# EAGLE design Glock-O-Bot_v1.1 (EAGLE 7.5.0)
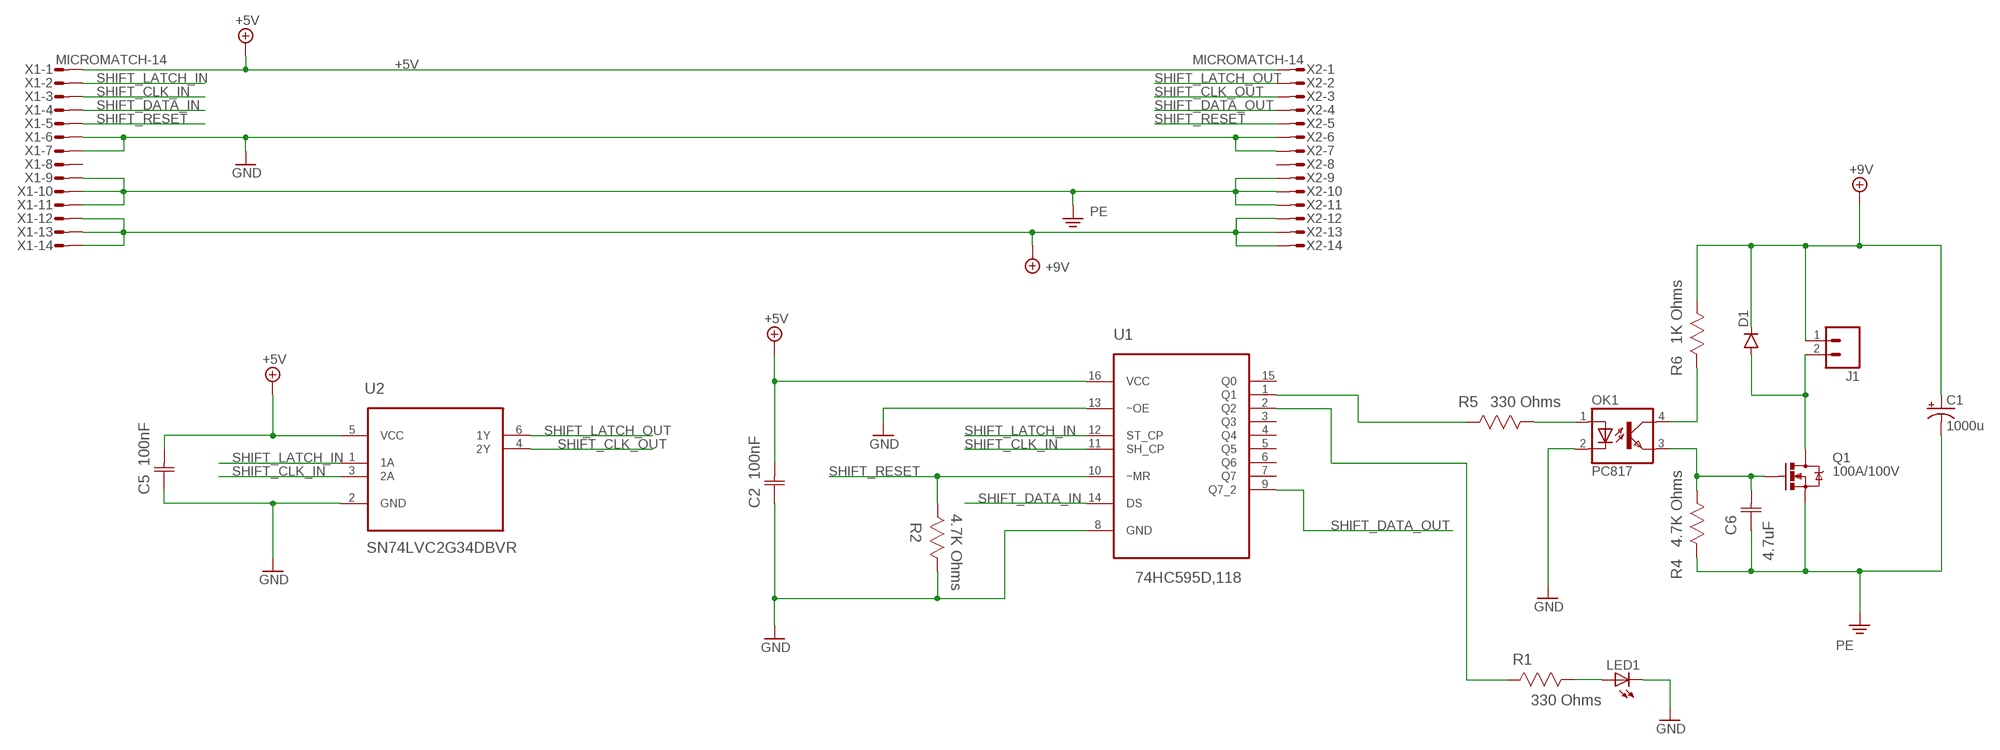
[diagram p0: schematic, sheet 1]

## Parts
C1  1000u  CAP_POLPTH4  [CPOL-RADIAL-1000UF-25V]
C2  100nF  C0805C104J5RACTU  [CAPC2013X110N]
C5  100nF  C0805C104J5RACTU  [CAPC2013X110N]
C6  4.7uF  C0805C104J5RACTU  [CAPC2013X110N]
D1  DIODEPTH  [DIODE-1N4001]
J1  M02JST-PTH-VERT  [JST-2-PTH-VERT]
LED1  LEDCHIPLED_1206  [CHIPLED_1206]
OK1  PC817  [DIL04]
Q1  100A/100V  MOSFET-NCHANNELPSMN7R0  [TO-263/D2PAK]
R1  330 Ohms  MC0.1W08051%9K1  [RESC2013X65N]
R2  4.7K Ohms  MC0.1W08051%9K1  [RESC2013X65N]
R4  4.7K Ohms  MC0.1W08051%9K1  [RESC2013X65N]
R5  330 Ohms  MC0.1W08051%9K1  [RESC2013X65N]
R6  1K Ohms  MC0.1W08051%9K1  [RESC2013X65N]
U1  74HC595D,118  [SOIC127P600X175-16N]
U2  SN74LVC2G34DBVR  [SOT95P280X145-6N]
X1  MICROMATCH-14  [MICROMATCH-14]
X2  MICROMATCH-14  [MICROMATCH-14]

## Nets
+5V: C2.2(C2) C5.2(C2) U1.16(VCC) U2.5(VCC) X1.1 X2.1
+9V: C1.+ D1.C J1.1 R6.1(R1) X1.12 X1.13 X1.14 X2.12 X2.13 X2.14
GND: C2.1(C1) C5.1(C1) LED1.C OK1.2(C) R2.1(R1) U1.8(GND) U1.13(~OE) U2.2(GND) X1.6 X1.7 X2.6 X2.7
N$1: D1.A J1.2 Q1.2(D)
N$2: R1.2(R2) U1.2(Q2)
N$3: C6.2(C2) OK1.3(EMIT) Q1.1(G) R4.1(R1)
N$4: LED1.A R1.1(R1)
N$5: OK1.4(COL) R6.2(R2)
N$6: R5.2(R2) U1.1(Q1)
N$7: OK1.1(A) R5.1(R1)
PE: C1.- C6.1(C1) Q1.3(S) R4.2(R2) X1.9 X1.10 X1.11 X2.9 X2.10 X2.11
SHIFT_CLK_IN: U1.11(SH_CP) U2.3(2A) X1.3
SHIFT_CLK_OUT: U2.4(2Y) X2.3
SHIFT_DATA_IN: U1.14(DS) X1.4
SHIFT_DATA_OUT: U1.9(Q7_2) X2.4
SHIFT_LATCH_IN: U1.12(ST_CP) U2.1(1A) X1.2
SHIFT_LATCH_OUT: U2.6(1Y) X2.2
SHIFT_RESET: R2.2(R2) U1.10(~MR) X1.5 X2.5
Unconnected: U1.3(Q3) U1.4(Q4) U1.5(Q5) U1.6(Q6) U1.7(Q7) U1.15(Q0) X1.8 X2.8

## Library data of the parts
C1 = SparkFun-Capacitors:CAP_POL: Capacitor Polarized These are standard SMD and PTH capacitors. Normally 10uF, 47uF, and 100uF in electrolytic and tantalum varieties. Always verify the external diameter of the through hole cap, it varies with capacity, voltage, and manufacturer. The EIA devices should be standard.; DESCRIPTION: 1000uF 16V; FARNELL: 9693610
C2 C5 = Kemet_By_element14_Batch_1:C0805C104J5RACTU: CAPACITOR, 0805; DESCRIPTION: 100nF 0805 50V; FARNELL: 1414663; MPN: C0805C104J5RACTU; OC_FARNELL: 1414663; OC_NEWARK: 64K2889; SUPPLIER: Kemet; TOLERANCE: ±5%; VOLTAGERATING: 50V
C6 = Kemet_By_element14_Batch_1:C0805C104J5RACTU: CAPACITOR, 0805; DESCRIPTION: 4.7uF 0805 16V; FARNELL: 1845746; MPN: C0805C104J5RACTU; OC_FARNELL: 1414663; OC_NEWARK: 64K2889; SUPPLIER: Murata; TOLERANCE: ±5%; VALUE: 100nF; VOLTAGERATING: 16V
D1 = SparkFun-DiscreteSemi:DIODE: Diode These are standard reverse protection diodes and small signal diodes. SMA package can handle up to about 1A. SOD-323 can handle about 200mA. What the SOD-323 package when ordering, there are some mfgs out there that are 5-pin packages.; DESCRIPTION: Diode 1N4001; FARNELL: 9564993
J1 = SparkFun-Connectors:M02: Standard 2-pin 0.1" header. Use with - straight break away headers ( PRT-00116) - right angle break away headers (PRT-00553) - swiss pins (PRT-00743) - machine pins (PRT-00117) - female headers (PRT-00115) Molex polarized connector foot print use with: PRT-08233 with associated crimp pins and housings. 2.54_SCREWTERM for use with PRT-10571. 3.5mm Screw Terminal footprints for PRT-08084 5mm Screw Terminal footprints for use with PRT-08432
LED1 = led:LED: LED OSRAM: - CHIPLED LG R971, LG N971, LY N971, LG Q971, LY Q971, LO R971, LY R971 LH N974, LH R974 LS Q976, LO Q976, LY Q976 LO Q996 - Hyper CHIPLED LW Q18S LB Q993, LB Q99A, LB R99A - SideLED LS A670, LO A670, LY A670, LG A670, LP A670 LB A673, LV A673, LT A673, LW A673 LH A674 LY A675 LS A676, LA A676, LO A676, LY A676, LW A676 LS A679, LY A679, LG A679 - Hyper Micro SIDELED® LS Y876, LA Y876, LO Y876, LY Y876 LT Y87S - SmartLED LW L88C, LW L88S LB L89C, LB L89S, LG L890 LS L89K, LO L89K, LY L89K LS L896, LA L896, LO L896, LY L896 - TOPLED LS T670, LO T670, LY T670, LG T670, LP T670 LSG T670, LSP T670, LSY T670, LOP T670, LYG T670 LG T671, LOG T671, LSG T671 LB T673, LV T673, LT T673, LW T673 LH T674 LS T676, LA T676, LO T676, LY T676, LB T676, LH T676, LSB T676, LW T676 LB T67C, LV T67C, LT T67C, LS T67K, LO T67K, LY T67K, LW E67C LS E67B, LA E67B, LO E67B, LY E67B, LB E67C, LV E67C, LT E67C LW T67C LS T679, LY T679, LG T679 LS T770, LO T770, LY T770, LG T770, LP T770 LB T773, LV T773, LT T773, LW T773 LH T774 LS E675, LA E675, LY E675, LS T675 LS T776, LA T776, LO T776, LY T776, LB T776 LHGB T686 LT T68C, LB T68C - Hyper Mini TOPLED® LB M676 - Mini TOPLED Santana® LG M470 LS M47K, LO M47K, LY M47K Source: http://www.osram.convergy.de LUXEON: - LUMILED® LXK2-PW12-R00, LXK2-PW12-S00, LXK2-PW14-U00, LXK2-PW14-V00 LXK2-PM12-R00, LXK2-PM12-S00, LXK2-PM14-U00 LXK2-PE12-Q00, LXK2-PE12-R00, LXK2-PE12-S00, LXK2-PE14-T00, LXK2-PE14-U00 LXK2-PB12-K00, LXK2-PB12-L00, LXK2-PB12-M00, LXK2-PB14-N00, LXK2-PB14-P00, LXK2-PB14-Q00 LXK2-PR12-L00, LXK2-PR12-M00, LXK2-PR14-Q00, LXK2-PR14-R00 LXK2-PD12-Q00, LXK2-PD12-R00, LXK2-PD12-S00 LXK2-PH12-R00, LXK2-PH12-S00 LXK2-PL12-P00, LXK2-PL12-Q00, LXK2-PL12-R00 Source: www.luxeon.com KINGBRIGHT: KA-3528ASYC Source: www.kingbright.com; DESCRIPTION: LED 1206; FARNELL: 8530076
OK1 = optocoupler:PC817: SHARP OPTO COUPLER; DESCRIPTION: FOD817A; FARNELL: 2322514; MPN: FOD817A; OC_FARNELL: 2322514; OC_NEWARK: 97K7059
Q1 = SparkFun-DiscreteSemi:MOSFET-NCHANNEL: Common NMOSFET Parts MFG P/N Store ID Prod ID FDD8780 TRANS-09984 SI7820DN TRANS-11055 FDS6630A IC-08089 2N7002PW TRANS-11151 FQP30N06L COM-10213 TRANS-10060 BSS123LT1G TRANS-08345 BSS138 TRANS-00830 BS170 2N7000; DESCRIPTION: BUK9637-100E; FARNELL: 2254193; PROD_ID: TRANS-12437
R1 R5 = Multicomp_By_element14_Batch_1:MC0.1W08051%9K1: RESISTOR, 0805; DESCRIPTION: 330R 0805; FARNELL: 2073741; MPN: MC0.1W08051%9K1; OC_FARNELL: 9333630; OC_NEWARK: 39K0321; SUPPLIER: Multicomp; TOLERANCE: ±1%; VALUE: 9.1K Ohms; WATTAGE: 1/10 W
R2 R4 = Multicomp_By_element14_Batch_1:MC0.1W08051%9K1: RESISTOR, 0805; DESCRIPTION: 4k7 0805; FARNELL: 9333266; MPN: MC0.1W08051%9K1; OC_FARNELL: 9333630; OC_NEWARK: 39K0321; SUPPLIER: Multicomp; TOLERANCE: ±1%; VALUE: 9.1K Ohms; WATTAGE: 1/10 W
R6 = Multicomp_By_element14_Batch_1:MC0.1W08051%9K1: RESISTOR, 0805; DESCRIPTION: 1k 0805; FARNELL: 2073606; MPN: MC0.1W08051%9K1; OC_FARNELL: 9333630; OC_NEWARK: 39K0321; SUPPLIER: Multicomp; TOLERANCE: ±1%; VALUE: 9.1K Ohms; WATTAGE: 1/10 W
U1 = NXP_By_element14_Batch_1:74HC595D,118: 8-bit serial-in, serial or parallel-out shift register with output latches 3-state; DESCRIPTION: 74HC595; FARNELL: 1201269; MPN: 74HC595D,118; OC_FARNELL: 1201269; OC_NEWARK: 78R6262; PACKAGE: SOIC-16; SUPPLIER: NXP Semiconductors
U2 = Texas Instruments_By_element14_Batch_1:SN74LVC2G34DBVR: DUAL BUFFER GATE; DESCRIPTION: 74LVC2G34DBVR; FARNELL: 1470888; MPN: SN74LVC2G34DBVR; OC_FARNELL: 1470888; OC_NEWARK: 76C4213; PACKAGE: SOT-23-6; SUPPLIER: Texas Instruments
X1 X2 = con-amp-micromatch:MICROMATCH-14: MicroMaTch 14 8-215464-4 / 1-215464-4 Drawing Number C-215464 DDEController.pdf; MF: FARNELL; MPN: 8-215464-4; OC_FARNELL: 3784678; OC_NEWARK: 19J6431

## Board
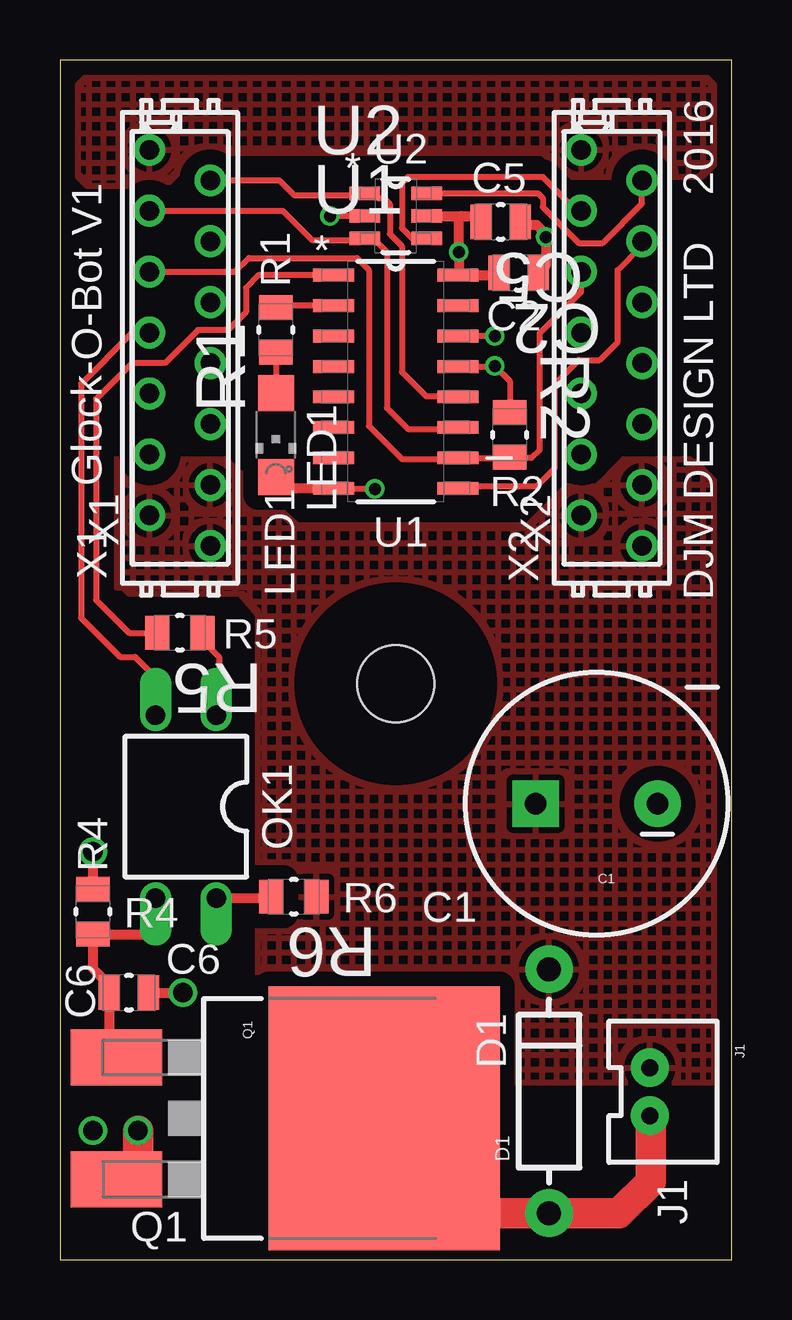
[diagram p1: board, top side]
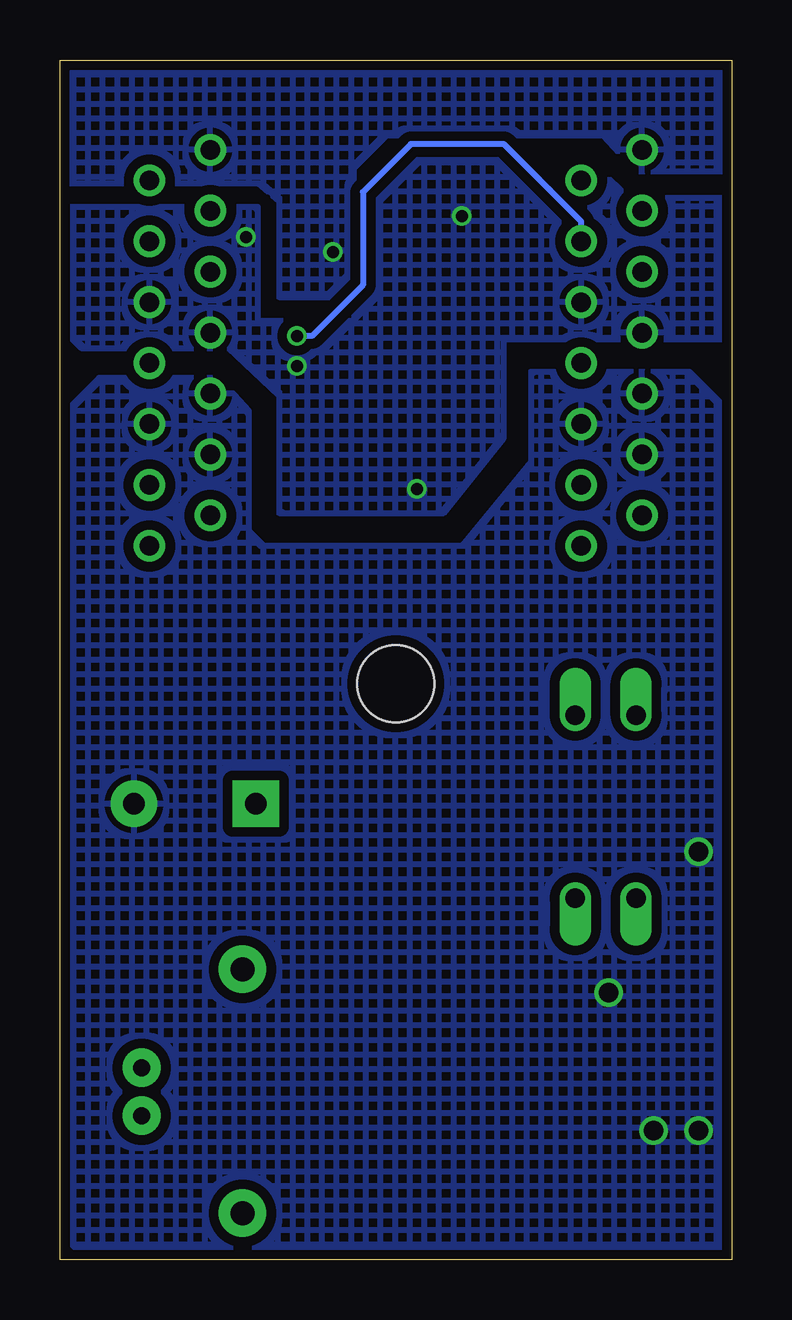
[diagram p2: board, bottom side, seen from below]

Size 28 x 50 mm. Coordinates in mm from the lower left corner, seen from the top.
Outline: 0,0 28,0 28,50 0,50 0,0
Copper layers (1*16): Top 0.035mm / dielectric 1.5mm / Bottom 0.035mm
Design rules "SeeedStudio_2layer_DRU_no_angle_20140221 *": minimum track width 8mil, minimum drill 16mil, track to track 8mil, track to pad 8mil, pad to pad 8mil, via to via 8mil, smd to smd 0mil, copper to edge 14mil, drill to drill 12mil, minimum pad ring 10mil, minimum via ring 6mil, stop-mask expansion 2mil, vias tented up to drill 100mil, thermal gap 10mil
Holes 3.2 mm at 14,24
tKeepout: area 10.5,20.5 to 17.5,27.5
bKeepout: area 10.5,20.5 to 17.5,27.5
tRestrict: area 10.5,20.5 to 17.5,27.5

### Footprints (pad centres in the part's own frame; a part is rotated, then mirrored left to right if it is on the bottom)
CPOL-RADIAL-1000UF-25V = drill 0.9 pad 1.93 square: + 2.54,0 | drill 0.9 pad 1.93: - -2.54,0
CAPC2013X110N = smd 0.914 x 1.448: 1 -0.813,0; 2 0.813,0
DIODE-1N4001 = drill 1 pad 1.981: A -5.08,0; C 5.08,0
JST-2-PTH-VERT = drill 0.7 pad 1.6: 1 -1,-0.55; 2 1,-0.55
CHIPLED_1206 = smd 1.5 x 1.5: A 0,-1.75; C 0,1.75
DIL04 = drill 0.813 offset: 1 -1.27,-3.81; 2 1.27,-3.81; 3 1.27,3.81; 4 -1.27,3.81
TO-263/D2PAK = smd 2.32 x 3.81: 1 -2.54,-7.045; 3 2.54,-7.045 | smd 11 x 9.65: 2 0,4.125
RESC2013X65N = smd 1.016 x 1.397: 1 -0.94,0; 2 0.94,0
SOIC127P600X175-16N = smd 1.702 x 0.533: 1 -2.591,4.445; 2 -2.591,3.175; 3 -2.591,1.905; 4 -2.591,0.635; 5 -2.591,-0.635; 6 -2.591,-1.905; 7 -2.591,-3.175; 8 -2.591,-4.445; 9 2.591,-4.445; 10 2.591,-3.175; 11 2.591,-1.905; 12 2.591,-0.635; 13 2.591,0.635; 14 2.591,1.905; 15 2.591,3.175; 16 2.591,4.445
SOT95P280X145-6N = smd 1.27 x 0.559: 1 -1.295,0.94; 2 -1.295,0; 3 -1.295,-0.94; 4 1.295,-0.94; 5 1.295,0; 6 1.295,0.94
MICROMATCH-14 = drill 0.813: 1 8.255,1.27; 2 6.985,-1.27; 3 5.715,1.27; 4 4.445,-1.27; 5 3.175,1.27; 6 1.905,-1.27; 7 0.635,1.27; 8 -0.635,-1.27; 9 -1.905,1.27; 10 -3.175,-1.27; 11 -4.445,1.27; 12 -5.715,-1.27; 13 -6.985,1.27; 14 -8.255,-1.27

### Placement (x,y rotation side)
C1  22.38,19 180 top
C2  19.12,41.12 180 top
C5  18.38,43.25 180 top
C6  2.88,11.12 180 top
D1  20.39,7.01 90 top
J1  25.14,7 270 top
LED1  9,34.38 180 top
OK1  5.25,18.88 180 top
Q1  9.4,5.88 270 top
R1  9,38.75 90 top
R2  18.75,34.38 270 top
R4  1.38,14.5 90 top
R5  5,26.12 180 top
R6  9.75,15.12 180 top
U1  14,36.59 0 top
U2  14,43.5 0 top
X1  5,38 90 top
X2  23,38 90 top

### Tracks (layer width: path | path; a pad name or v marks a point on that pad's centre or on a via)
+5V  (via drill 0.5)
  Top 0.254: 17.31,43.5 C5.2 | 18.22,41.03 C2.2 | 16.62,41.07 U1.16 | 16.62,43.38 16.75,43.5
  Top 0.406: U2.5 16.75,43.5 17.31,43.5 | U1.16 18.22,41.03 | 16.62,41.07 v16.62,42 16.62,43.38
  pour Bottom (isolate 0.4, rank 3, hatched): 0.25,49.12 0.62,49.88 27.25,49.75 27.88,49.12 27.88,49 28,48.88 27.88,44.88 19.75,44.88 18.88,44.12 18.88,40.12 16.25,40.12 15.75,40.62 15.75,45.5 14.38,46.88 5.38,46.88 4,45.38 0.25,45.38
  pour Top (isolate 0.61, hatched): 0.38,48.62 1.25,49.5 26.75,49.5 27.62,48.62 27.62,46 26.75,45.12 21.12,45.12 20.12,46.12 5.75,46.12 4.38,44.75 1.12,44.75 0.38,45.5
+9V
  pour Top (isolate 0.61, hatched): 1.5,28.88 1.5,33.38 6.88,33.38 9.88,30.62 19.5,30.62 21.12,32.25 22.38,32.25 23.5,33.38 26.25,33.38 26.38,33.25 26.5,33.25 27.38,32.38 27.38,7.38 16.25,7.38 16.25,9.38 13.25,9.38 13.12,9.5 13.25,10.5 8.25,10.5 8.25,26.88 7.5,27.75 2.88,27.75 2.62,28 2.38,28
GND  (via drill 0.5)
  Top 0.254: U1.13 17.98,37.23 v18.12,37.25 18.75,36.62 R2.1 | OK1.2 3.98,24.27 3.12,25.12 2.5,25.12 0.88,26.75 0.88,36.5 3.01,38.63 X1.7 | 9.48,32.15 LED1.C | U2.2 v11.25,43.5 | U1.8 13.11,32.15 v13.12,32.12
  Top 0.406: U1.8 9.48,32.15 | C2.1 20.25,41.44 v20.25,42.62 20.25,42.75 19.88,43.12 19.31,43.12 C5.1
  pour Bottom (isolate 0.406, rank 2, hatched): 0.25,44.25 4.25,44.25 6.75,46.62 14,46.62 15.75,44.88 15.75,39.12 19.75,39.12 19.75,43.88 28,43.88 28,38.88 27.12,38 21,38 18.88,36 18.88,31.12 12,31.12 9.5,34.25 9.5,38.38 0.25,38.38
N$1
  Top 1.27: J1.2 24.62,5.96 24.62,3.25 23.31,1.94 D1.A 13.56,1.94 13.38,2.12 13.38,5.83 Q1.2
N$2
  Top 0.254: U1.2 9,39.77 R1.2
N$3
  Top 0.406: OK1.3 4,15.04 4,13.62 3.94,13.56 R4.1 1.38,12.12 2.06,11.44 C6.2 2.06,8.55 Q1.1
N$4
  Top 0.254: R1.1 LED1.A
N$5
  Top 0.406: OK1.4 8.75,15.06 R6.2
N$6
  Top 0.254: U1.1 8.29,41.03 7.75,40.5 7.75,39.5 7,38.75 5.75,38.75 4.38,37.38 3,37.38 1.5,35.88 1.5,27.5 2.88,26.12 R5.2
N$7
  Top 0.254: R5.1 5.94,25.81 6.62,25.12 6.62,22.79 OK1.1
PE  (via drill 0.8)
  Top 0.406: C6.1 v5.12,11.12 | R4.2 v1.38,17
  Top 1.27: Q1.3 3.22,3.35 3.25,3.38 v3.25,5.38
  other vias: 1.38,5.38
  pour Bottom (isolate 0.406, hatched): 0.12,35.38 1.75,37 8.38,37 8.38,33.25 11.25,29.75 19.5,29.75 20.12,30.38 20.12,35.38 21.38,36.75 26.38,36.75 27.62,35.5 27.62,0.75 27,0.12 0.75,0.12 0.75,0.25 0.12,0.88
SHIFT_CLK_IN
  Top 0.254: U1.11 16.53,34.62 14.5,34.62 13.62,35.5 13.62,42 13.06,42.56 U2.3 12.64,42.5 10.5,42.5 9.29,43.72 X1.3
SHIFT_CLK_OUT
  Top 0.254: X2.3 21.54,43.72 20.12,45.12 14.5,45.12 14.25,44.88 14.25,43 14.75,42.5 15.23,42.5 U2.4
SHIFT_DATA_IN  (via drill 0.5)
  Top 0.254: v18.12,38.5 U1.14
  Bottom 0.254: X1.4 6.27,43.27 9.5,46.5 13.38,46.5 15.38,44.5 15.38,40.62 17.5,38.5 v18.12,38.5
SHIFT_DATA_OUT
  Top 0.254: U1.9 16.7,32.25 19.88,32.25 20.62,33 20.62,36.5 21.62,37.5 22.5,37.5 23.25,38.25 23.25,41.25 24.27,42.27 X2.4
SHIFT_LATCH_IN
  Top 0.254: X1.2 9.14,44.98 9.75,44.38 12.64,44.38 | 12.64,44.38 U2.1 | 12.64,44.38 13.12,44.38 13.25,44.25 13.5,44.25 13.75,44 13.75,42.75 14.25,42.25 14.25,37 15.25,36 16.55,36 U1.12
SHIFT_LATCH_OUT
  Top 0.254: U2.6 19.93,44.44 20.12,44.25 20.12,43.88 21.62,42.38 22.62,42.38 24.27,44.02 X2.2
SHIFT_RESET
  Top 0.254: X1.5 7.3,41.17 7.88,41.75 12.38,41.75 12.88,41.25 12.88,34.75 14.25,33.38 16.55,33.38 U1.10 18.75,33.41 | X2.5 21.74,41.14 21.74,40.34 20,38.61 20,33.75 19.66,33.41 18.75,33.41 | 18.75,33.41 R2.2

### Text on the board
_tsilk: U2 | C5 | * | 2016 | R1 | * | C2 | Glock-O-Bot V1 | LED1 | R2 | U1 | X1 | X2 | DJM DESIGN LTD | R5 | OK1 | R6 | R4 | C1 | C6 | D1 | J1 | Q1